# Altium schematic sheet Reset.SchDoc
size A4
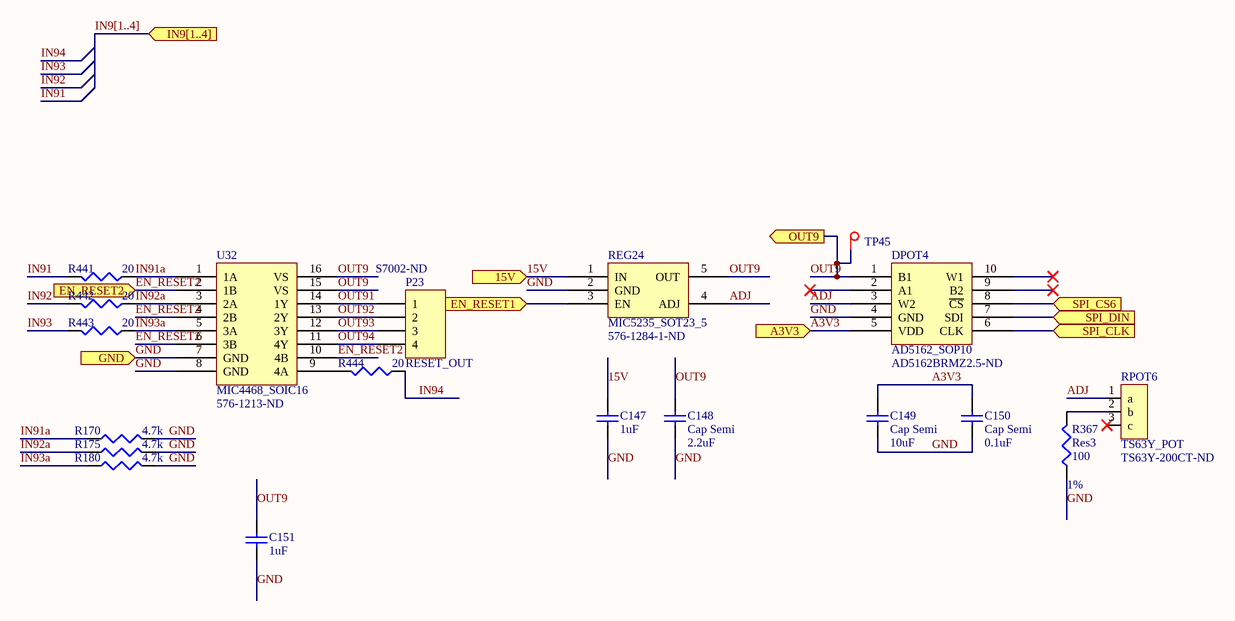
[diagram p0: Reset.SchDoc]

## Parts
C147  value 1uF  [J1-0603]  (hidden comment: Cap)
C148  Cap Semi  value 2.2uF  [J1-0603]
C149  Cap Semi  value 10uF  [RES_0805]
C150  Cap Semi  value 0.1uF  [J1-0603]
C151  value 1uF  [J1-0603]  (hidden comment: Cap)
DPOT4  AD5162_SOP10  Supplier Part Number 1: AD5162BRMZ2.5-ND  [AD5162_SOP10]
P23  RESET_OUT  Supplier Part Number 1: S7002-ND  [HDR1X4]
R170  value 4.7k  [J1-0603]  (hidden comment: Res3)
R175  value 4.7k  [J1-0603]  (hidden comment: Res3)
R180  value 4.7k  [J1-0603]  (hidden comment: Res3)
R367  Res3  value 100  Tol: 1%  [J1-0603]
R441  value 20  [R0402]  (hidden comment: Res3)
R442  value 20  [R0402]  (hidden comment: Res3)
R443  value 20  [R0402]  (hidden comment: Res3)
R444  value 20  [R0402]  (hidden comment: Res3)
REG24  MIC5235_SOT23_5  Supplier Part Number 1: 576-1284-1-ND  [MIC5235_SOT23_5]
RPOT6  TS63Y_POT  Supplier Part Number 1: TS63Y-200CT-ND  [TS63Y_POT]
TP45  Test Point  [TestPoint]  (value not drawn)
U32  MIC4468_SOIC16  Supplier Part Number 1: 576-1213-ND  [MIC4468_SOIC16]

## Ports
15V (in), A3V3 (in), EN_RESET1 (in), EN_RESET2 (in), GND (in), IN9[1..4] (in), OUT9 (out), SPI_CLK (in), SPI_CS6 (in), SPI_DIN (in)

## Nets
15V: C147.1 REG24.1(IN) ; port 15V
A3V3: C149.2 C150.2 DPOT4.5(VDD) ; port A3V3
ADJ: DPOT4.3(W2) REG24.4(ADJ) RPOT6.1(a)
EN_RESET1: REG24.3(EN) ; port EN_RESET1
EN_RESET2: U32.2(1B) U32.4(2B) U32.6(3B) U32.10(4B) ; port EN_RESET2
GND: C147.2 C148.1 C149.1 C150.1 C151.2 DPOT4.4(GND) R170.2 R175.2 R180.2 R367.1 REG24.2(GND) U32.7(GND) U32.8(GND) ; port GND
IN91: R441.2
IN91a: R170.1 R441.1 U32.1(1A)
IN92: R442.2
IN92a: R175.1 R442.1 U32.3(2A)
IN93: R443.2
IN93a: R180.1 R443.1 U32.5(3A)
IN94: R444.1
OUT9: C148.2 C151.1 DPOT4.1(B1) REG24.5(OUT) TP45.1(TP) U32.15(VS) U32.16(VS) ; port OUT9
OUT91: P23.1 U32.14(1Y)
OUT92: P23.2 U32.13(2Y)
OUT93: P23.3 U32.12(3Y)
OUT94: P23.4 U32.11(4Y)
SPI_CLK: DPOT4.6(CLK) ; port SPI_CLK
SPI_CS6: DPOT4.8(~{CS}) ; port SPI_CS6
SPI_DIN: DPOT4.7(SDI) ; port SPI_DIN
NetR367_2: R367.2 RPOT6.2(b)
NetR444_2: R444.2 U32.9(4A)

Not connected (* = marked no-connect by the designer): DPOT4 2(A1)* 9(B2)* 10(W1)*; RPOT6 3(c)*

## Buses and harness runs
bus IN9[1..4] = port IN9[1..4]

## Library data of the parts
C147 C151 = Cap: Capacitor; Published: 8-Jun-2000; LatestRevisionDate: 17-Jul-2002; LatestRevisionNote: Re-released for DXP Platform.; PackageReference: RAD-0.3; Publisher: Altium Limited; PackageDescription: Radial Cap, Thru-Hole; 2 Leads; 0.3 in Pin Spacing; Supplier 1: Digi-Key; Supplier Part Number 1: 1276-1184-1-ND
C148-C150 = Cap Semi: Capacitor (Semiconductor SIM Model); Published: 8-Jun-2000; LatestRevisionDate: 29-May-2009; LatestRevisionNote: IPC-7351 Footprint Added.; PackageReference: C1206; Publisher: Altium Limited; PackageDescription: Chip Capacitor; Supplier 1: Digi-Key
  C148: Supplier Part Number 1: 1276-1879-1-ND
  C149: Supplier Part Number 1: 490-3340-1-ND
  C150: Supplier Part Number 1: 490-1532-1-ND
P23 = Header 4: Header, 4-Pin; LatestRevisionDate: 17-Jul-2002; LatestRevisionNote: Re-released for DXP Platform.; Publisher: Altium Limited; Supplier 1: Digi-Key
R170 R175 R180 R367 R441-R444 = Res3: Resistor; Published: 8-Jun-2000; LatestRevisionDate: 29-May-2009; LatestRevisionNote: IPC-7351 Footprint Added.; PackageReference: J1-0603; Publisher: Altium Limited; PackageDescription: Chip Resistor; Supplier 1: Digi-Key
  R170 R175 R180: Supplier Part Number 1: P4.7KGCT-ND
  R367: Supplier Part Number 1: P100HCT-ND
  R441-R444: Supplier Part Number 1: P20JCT-ND
DPOT4 = AD5162_SOP10: Supplier 1: Digi-Key
REG24 = MIC5235_SOT23_5: Supplier 1: Digi-Key
RPOT6 = TS63Y_POT: Supplier 1: Digi-Key
TP45 = Test Point: Supplier 1: Digi-Key; Supplier Part Number 1: 36-5019CT-ND
U32 = MIC4468_SOIC16: Supplier 1: Digi-Key